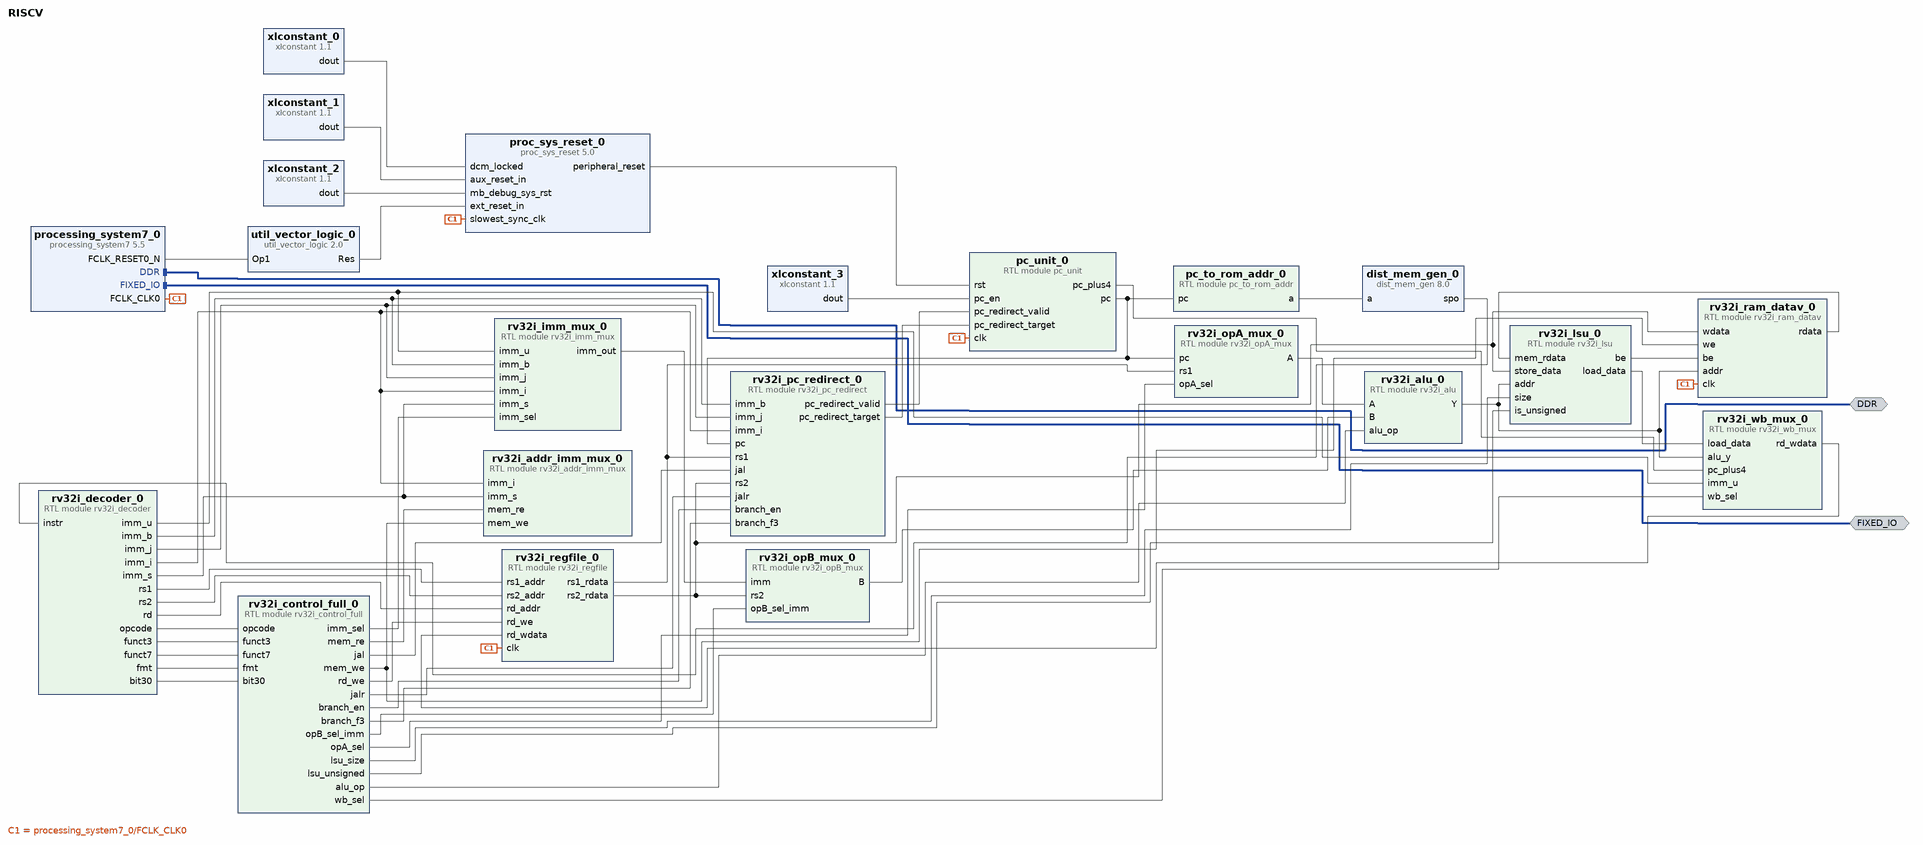
[diagram p0: block diagram of the top level]
# Vivado block design RISCV, xc7z010clg225-2, Vivado 2019.1
create_bd_design RISCV

create_bd_intf_port -mode Master -vlnv xilinx.com:interface:ddrx_rtl:1.0 DDR
create_bd_intf_port -mode Master -vlnv xilinx.com:display_processing_system7:fixedio_rtl:1.0 FIXED_IO

create_bd_cell -type ip -vlnv xilinx.com:ip:proc_sys_reset:5.0 proc_sys_reset_0
set_property -dict {CONFIG.C_AUX_RESET_HIGH 0} [get_bd_cells proc_sys_reset_0]
create_bd_cell -type ip -vlnv xilinx.com:ip:processing_system7:5.5 processing_system7_0
set_property -dict [list \
  CONFIG.PCW_APU_PERIPHERAL_FREQMHZ 666.666666 \
  CONFIG.PCW_CPU_CPU_6X4X_MAX_RANGE 767 \
  CONFIG.PCW_DM_WIDTH 2 \
  CONFIG.PCW_DQS_WIDTH 2 \
  CONFIG.PCW_DQ_WIDTH 16 \
  CONFIG.PCW_ENET0_PERIPHERAL_ENABLE 0 \
  CONFIG.PCW_FPGA0_PERIPHERAL_FREQMHZ 25 \
  CONFIG.PCW_FPGA1_PERIPHERAL_FREQMHZ 50 \
  CONFIG.PCW_GPIO_MIO_GPIO_ENABLE 0 \
  CONFIG.PCW_MIO_PRIMITIVE 32 \
  CONFIG.PCW_PERIPHERAL_BOARD_PRESET None \
  CONFIG.PCW_PRESET_BANK1_VOLTAGE {LVCMOS 3.3V} \
  CONFIG.PCW_QSPI_PERIPHERAL_ENABLE 0 \
  CONFIG.PCW_SD0_PERIPHERAL_ENABLE 0 \
  CONFIG.PCW_UART1_PERIPHERAL_ENABLE 0 \
  CONFIG.PCW_UIPARAM_DDR_BUS_WIDTH {16 Bit} \
  CONFIG.PCW_UIPARAM_DDR_FREQ_MHZ 533.333333 \
  CONFIG.PCW_UIPARAM_DDR_PARTNO {MT41J128M8 JP-125} \
  CONFIG.PCW_USB0_PERIPHERAL_ENABLE 0 \
  CONFIG.PCW_USE_M_AXI_GP0 0 \
] [get_bd_cells processing_system7_0]
# 316 more settings of processing_system7_0 are not shown: defaults, MIO pin electricals, DDR timing, and values the tool derives
create_bd_cell -type ip -vlnv xilinx.com:ip:util_vector_logic:2.0 util_vector_logic_0
set_property -dict {CONFIG.C_OPERATION not CONFIG.C_SIZE 1} [get_bd_cells util_vector_logic_0]
create_bd_cell -type ip -vlnv xilinx.com:ip:xlconstant:1.1 xlconstant_0
create_bd_cell -type ip -vlnv xilinx.com:ip:xlconstant:1.1 xlconstant_1
set_property -dict {CONFIG.CONST_VAL 0} [get_bd_cells xlconstant_1]
create_bd_cell -type ip -vlnv xilinx.com:ip:xlconstant:1.1 xlconstant_2
set_property -dict {CONFIG.CONST_VAL 0} [get_bd_cells xlconstant_2]
create_bd_cell -type ip -vlnv xilinx.com:ip:xlconstant:1.1 xlconstant_3
create_bd_cell -type module -reference pc_unit pc_unit_0
create_bd_cell -type module -reference rv32i_decoder rv32i_decoder_0
create_bd_cell -type module -reference rv32i_regfile rv32i_regfile_0
create_bd_cell -type module -reference rv32i_control_full rv32i_control_full_0
create_bd_cell -type module -reference rv32i_ram_datav rv32i_ram_datav_0
create_bd_cell -type module -reference rv32i_alu rv32i_alu_0
create_bd_cell -type module -reference rv32i_lsu rv32i_lsu_0
create_bd_cell -type module -reference rv32i_addr_imm_mux rv32i_addr_imm_mux_0
create_bd_cell -type module -reference rv32i_wb_mux rv32i_wb_mux_0
create_bd_cell -type module -reference rv32i_pc_redirect rv32i_pc_redirect_0
create_bd_cell -type module -reference rv32i_imm_mux rv32i_imm_mux_0
create_bd_cell -type module -reference rv32i_opA_mux rv32i_opA_mux_0
create_bd_cell -type module -reference rv32i_opB_mux rv32i_opB_mux_0
create_bd_cell -type ip -vlnv xilinx.com:ip:dist_mem_gen:8.0 dist_mem_gen_0
set_property -dict [list \
  CONFIG.coefficient_file ../../../../../../../../rv32i_vscode/prog.coe \
  CONFIG.data_width 32 \
  CONFIG.depth 256 \
  CONFIG.memory_type rom \
] [get_bd_cells dist_mem_gen_0]
create_bd_cell -type module -reference pc_to_rom_addr pc_to_rom_addr_0

# ---- connections ----

connect_bd_intf_net [get_bd_intf_ports DDR] [get_bd_intf_pins processing_system7_0/DDR]
connect_bd_intf_net [get_bd_intf_ports FIXED_IO] [get_bd_intf_pins processing_system7_0/FIXED_IO]
connect_bd_net [get_bd_pins xlconstant_0/dout] [get_bd_pins proc_sys_reset_0/dcm_locked]
connect_bd_net [get_bd_pins xlconstant_1/dout] [get_bd_pins proc_sys_reset_0/aux_reset_in]
connect_bd_net [get_bd_pins xlconstant_2/dout] [get_bd_pins proc_sys_reset_0/mb_debug_sys_rst]
connect_bd_net [get_bd_pins processing_system7_0/FCLK_RESET0_N] [get_bd_pins util_vector_logic_0/Op1]
connect_bd_net [get_bd_pins util_vector_logic_0/Res] [get_bd_pins proc_sys_reset_0/ext_reset_in]
connect_bd_net [get_bd_pins processing_system7_0/FCLK_CLK0] \
  [get_bd_pins proc_sys_reset_0/slowest_sync_clk] [get_bd_pins pc_unit_0/clk] [get_bd_pins rv32i_regfile_0/clk] \
  [get_bd_pins rv32i_ram_datav_0/clk]
connect_bd_net [get_bd_pins proc_sys_reset_0/peripheral_reset] [get_bd_pins pc_unit_0/rst]
connect_bd_net [get_bd_pins pc_unit_0/pc] [get_bd_pins rv32i_pc_redirect_0/pc] [get_bd_pins rv32i_opA_mux_0/pc] [get_bd_pins pc_to_rom_addr_0/pc]
connect_bd_net [get_bd_pins xlconstant_3/dout] [get_bd_pins pc_unit_0/pc_en]
connect_bd_net [get_bd_pins rv32i_decoder_0/rs1] [get_bd_pins rv32i_regfile_0/rs1_addr]
connect_bd_net [get_bd_pins rv32i_decoder_0/rs2] [get_bd_pins rv32i_regfile_0/rs2_addr]
connect_bd_net [get_bd_pins rv32i_decoder_0/rd] [get_bd_pins rv32i_regfile_0/rd_addr]
connect_bd_net [get_bd_pins rv32i_decoder_0/opcode] [get_bd_pins rv32i_control_full_0/opcode]
connect_bd_net [get_bd_pins rv32i_decoder_0/funct3] [get_bd_pins rv32i_control_full_0/funct3]
connect_bd_net [get_bd_pins rv32i_decoder_0/funct7] [get_bd_pins rv32i_control_full_0/funct7]
connect_bd_net [get_bd_pins rv32i_decoder_0/fmt] [get_bd_pins rv32i_control_full_0/fmt]
connect_bd_net [get_bd_pins rv32i_decoder_0/bit30] [get_bd_pins rv32i_control_full_0/bit30]
connect_bd_net [get_bd_pins rv32i_regfile_0/rs2_rdata] \
  [get_bd_pins rv32i_ram_datav_0/wdata] [get_bd_pins rv32i_lsu_0/store_data] [get_bd_pins rv32i_pc_redirect_0/rs2] \
  [get_bd_pins rv32i_opB_mux_0/rs2]
connect_bd_net [get_bd_pins rv32i_control_full_0/mem_we] [get_bd_pins rv32i_ram_datav_0/we] [get_bd_pins rv32i_addr_imm_mux_0/mem_we]
connect_bd_net [get_bd_pins rv32i_lsu_0/be] [get_bd_pins rv32i_ram_datav_0/be]
connect_bd_net [get_bd_pins rv32i_ram_datav_0/rdata] [get_bd_pins rv32i_lsu_0/mem_rdata]
connect_bd_net [get_bd_pins rv32i_control_full_0/lsu_size] [get_bd_pins rv32i_lsu_0/size]
connect_bd_net [get_bd_pins rv32i_control_full_0/lsu_unsigned] [get_bd_pins rv32i_lsu_0/is_unsigned]
connect_bd_net [get_bd_pins rv32i_regfile_0/rs1_rdata] [get_bd_pins rv32i_pc_redirect_0/rs1] [get_bd_pins rv32i_opA_mux_0/rs1]
connect_bd_net [get_bd_pins rv32i_control_full_0/mem_re] [get_bd_pins rv32i_addr_imm_mux_0/mem_re]
connect_bd_net [get_bd_pins rv32i_decoder_0/imm_i] \
  [get_bd_pins rv32i_addr_imm_mux_0/imm_i] [get_bd_pins rv32i_pc_redirect_0/imm_i] [get_bd_pins rv32i_imm_mux_0/imm_i]
connect_bd_net [get_bd_pins rv32i_decoder_0/imm_s] [get_bd_pins rv32i_addr_imm_mux_0/imm_s] [get_bd_pins rv32i_imm_mux_0/imm_s]
connect_bd_net [get_bd_pins rv32i_control_full_0/alu_op] [get_bd_pins rv32i_alu_0/alu_op]
connect_bd_net [get_bd_pins rv32i_alu_0/Y] [get_bd_pins rv32i_ram_datav_0/addr] [get_bd_pins rv32i_lsu_0/addr] [get_bd_pins rv32i_wb_mux_0/alu_y]
connect_bd_net [get_bd_pins rv32i_control_full_0/wb_sel] [get_bd_pins rv32i_wb_mux_0/wb_sel]
connect_bd_net [get_bd_pins rv32i_lsu_0/load_data] [get_bd_pins rv32i_wb_mux_0/load_data]
connect_bd_net [get_bd_pins pc_unit_0/pc_plus4] [get_bd_pins rv32i_wb_mux_0/pc_plus4]
connect_bd_net [get_bd_pins rv32i_decoder_0/imm_u] [get_bd_pins rv32i_wb_mux_0/imm_u] [get_bd_pins rv32i_imm_mux_0/imm_u]
connect_bd_net [get_bd_pins rv32i_wb_mux_0/rd_wdata] [get_bd_pins rv32i_regfile_0/rd_wdata]
connect_bd_net [get_bd_pins rv32i_control_full_0/rd_we] [get_bd_pins rv32i_regfile_0/rd_we]
connect_bd_net [get_bd_pins rv32i_decoder_0/imm_b] [get_bd_pins rv32i_pc_redirect_0/imm_b] [get_bd_pins rv32i_imm_mux_0/imm_b]
connect_bd_net [get_bd_pins rv32i_decoder_0/imm_j] [get_bd_pins rv32i_pc_redirect_0/imm_j] [get_bd_pins rv32i_imm_mux_0/imm_j]
connect_bd_net [get_bd_pins rv32i_control_full_0/jal] [get_bd_pins rv32i_pc_redirect_0/jal]
connect_bd_net [get_bd_pins rv32i_control_full_0/jalr] [get_bd_pins rv32i_pc_redirect_0/jalr]
connect_bd_net [get_bd_pins rv32i_control_full_0/branch_en] [get_bd_pins rv32i_pc_redirect_0/branch_en]
connect_bd_net [get_bd_pins rv32i_control_full_0/branch_f3] [get_bd_pins rv32i_pc_redirect_0/branch_f3]
connect_bd_net [get_bd_pins rv32i_pc_redirect_0/pc_redirect_valid] [get_bd_pins pc_unit_0/pc_redirect_valid]
connect_bd_net [get_bd_pins rv32i_pc_redirect_0/pc_redirect_target] [get_bd_pins pc_unit_0/pc_redirect_target]
connect_bd_net [get_bd_pins rv32i_control_full_0/imm_sel] [get_bd_pins rv32i_imm_mux_0/imm_sel]
connect_bd_net [get_bd_pins rv32i_control_full_0/opA_sel] [get_bd_pins rv32i_opA_mux_0/opA_sel]
connect_bd_net [get_bd_pins rv32i_imm_mux_0/imm_out] [get_bd_pins rv32i_opB_mux_0/imm]
connect_bd_net [get_bd_pins rv32i_control_full_0/opB_sel_imm] [get_bd_pins rv32i_opB_mux_0/opB_sel_imm]
connect_bd_net [get_bd_pins rv32i_opA_mux_0/A] [get_bd_pins rv32i_alu_0/A]
connect_bd_net [get_bd_pins rv32i_opB_mux_0/B] [get_bd_pins rv32i_alu_0/B]
connect_bd_net [get_bd_pins dist_mem_gen_0/spo] [get_bd_pins rv32i_decoder_0/instr]
connect_bd_net [get_bd_pins pc_to_rom_addr_0/a] [get_bd_pins dist_mem_gen_0/a]

validate_bd_design
save_bd_design
